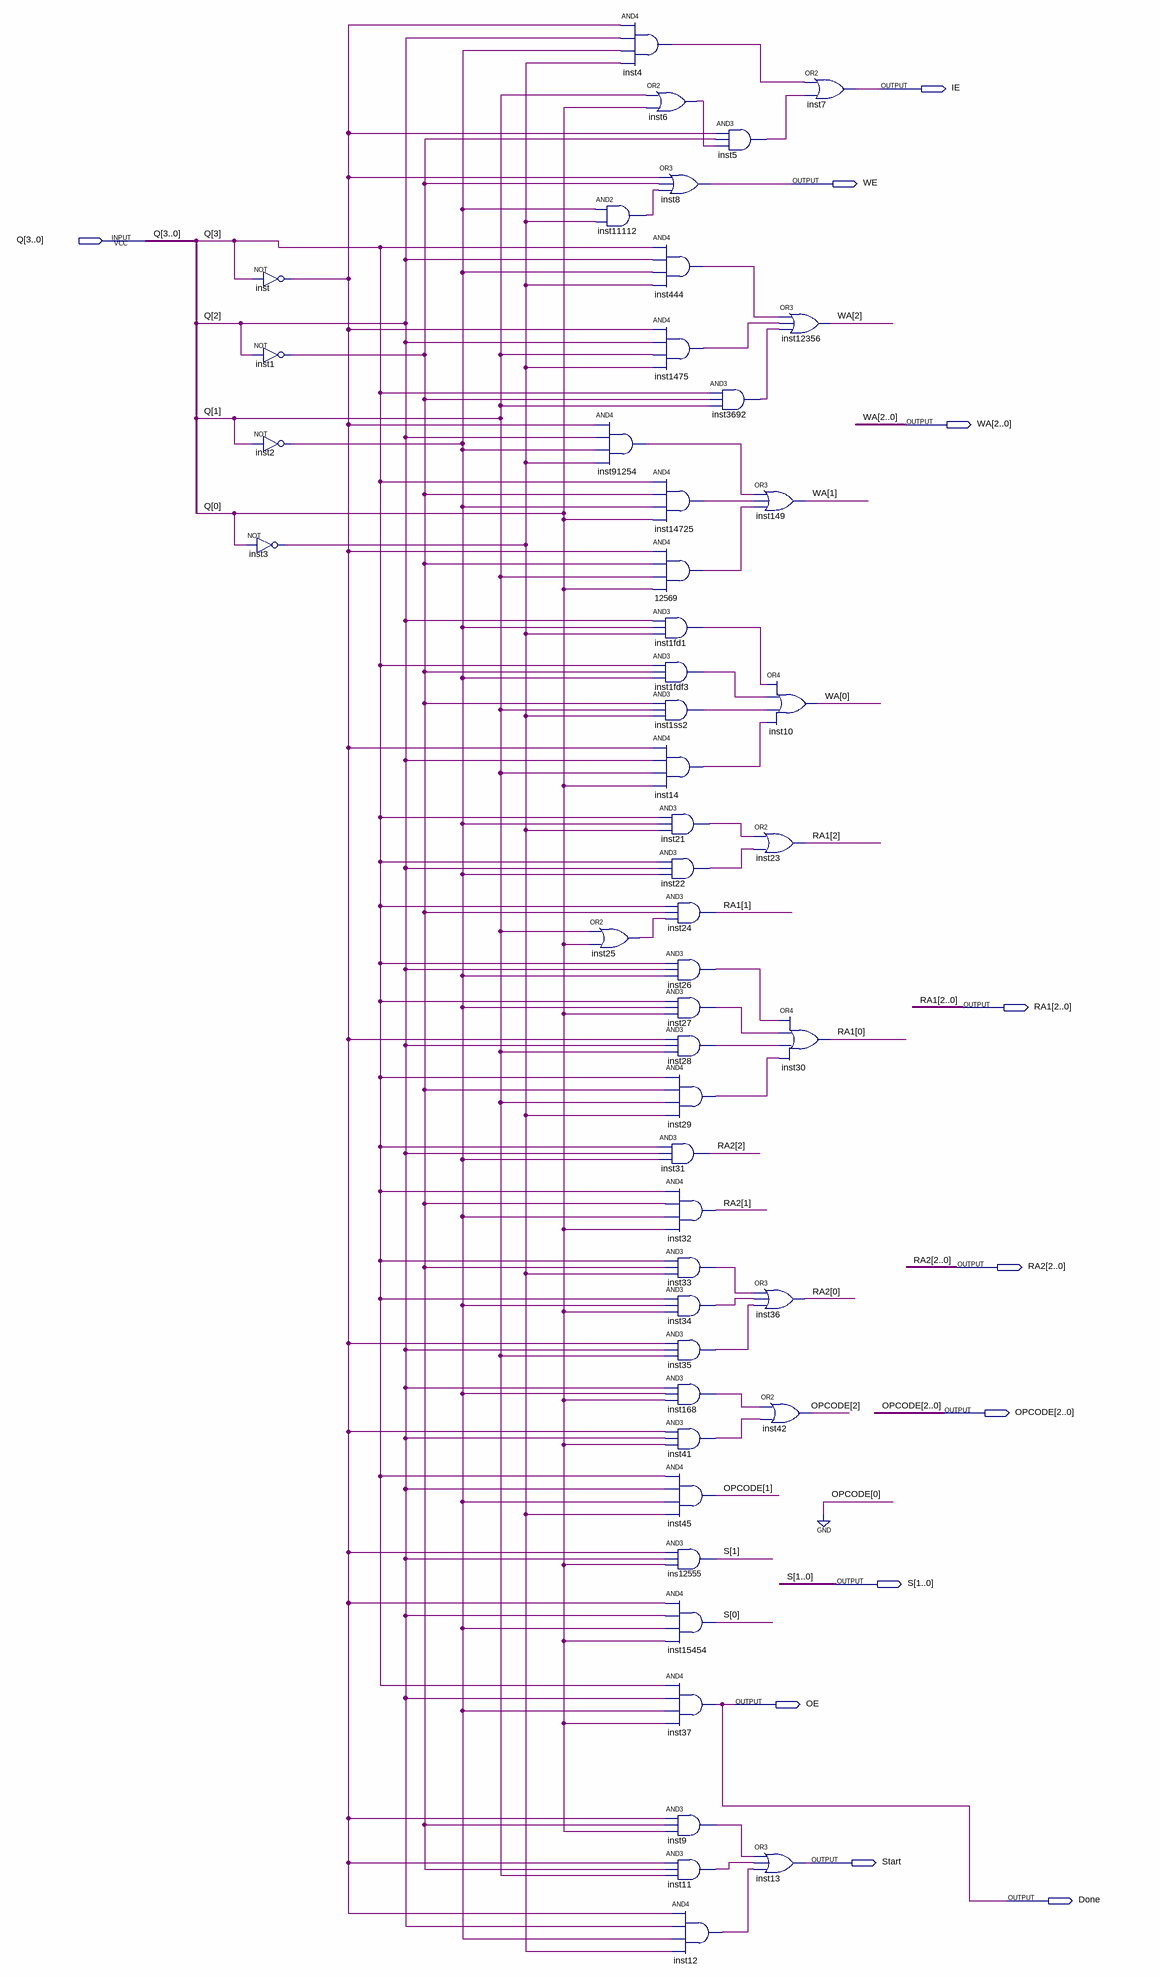
[diagram p0: schematic sheet]
// Quartus schematic OUTPUT.bdf as structural Verilog: 50 symbols, 11 pins
module OUTPUT (
  input  [3:0] Q,
  output IE,
  output WE,
  output [2:0] WA,
  output [2:0] RA1,
  output [2:0] RA2,
  output [2:0] OPCODE,
  output [1:0] S,
  output OE,
  output Start,
  output Done
);

  wire inst1_out, inst1fd1_out, inst1fdf3_out, inst1ss2_out, inst2_out, inst3_out, inst4_out, inst5_out,
       inst6_out, inst9_out, inst11_out, inst12_out, inst14_out, inst21_out, inst22_out, inst25_out,
       inst26_out, inst27_out, inst28_out, inst29_out, inst33_out, inst34_out, inst35_out, inst41_out,
       inst168_out, inst444_out, inst1475_out, inst3692_out, inst11112_out, inst14725_out, inst91254_out,
       inst_out, n12569_out;

  not inst3 (inst3_out, Q[0]);
  not inst (inst_out, Q[3]);
  not inst1 (inst1_out, Q[2]);
  not inst2 (inst2_out, Q[1]);
  and inst11112 (inst11112_out, inst2_out, inst3_out);
  and inst91254 (inst91254_out, inst_out, Q[2], inst2_out, inst3_out);
  or inst25 (inst25_out, Q[1], Q[0]);
  and inst4 (inst4_out, inst_out, Q[2], inst2_out, inst3_out);
  or inst6 (inst6_out, Q[1], Q[0]);
  and inst444 (inst444_out, Q[3], Q[2], inst2_out, inst3_out);
  and inst1475 (inst1475_out, inst_out, Q[2], Q[1], inst3_out);
  and inst14725 (inst14725_out, Q[3], inst1_out, inst2_out, Q[0]);
  and u_12569 (n12569_out, inst_out, inst1_out, Q[1], Q[0]);
  and inst1fd1 (inst1fd1_out, Q[2], inst2_out, inst3_out);
  and inst1fdf3 (inst1fdf3_out, Q[3], inst1_out, inst2_out);
  and inst1ss2 (inst1ss2_out, inst1_out, Q[1], inst3_out);
  and inst14 (inst14_out, inst_out, Q[2], Q[1], Q[0]);
  or inst8 (WE, inst_out, inst1_out, inst11112_out);
  and inst21 (inst21_out, Q[3], inst2_out, inst3_out);
  and inst22 (inst22_out, Q[3], Q[2], inst2_out);
  and inst24 (RA1[1], Q[3], inst1_out, inst25_out);
  and inst26 (inst26_out, Q[3], Q[2], inst2_out);
  and inst27 (inst27_out, Q[3], inst2_out, Q[0]);
  and inst28 (inst28_out, inst_out, Q[2], Q[1]);
  and inst29 (inst29_out, Q[3], inst1_out, Q[1], inst3_out);
  and inst31 (RA2[2], Q[3], Q[2], inst2_out);
  and inst32 (RA2[1], Q[3], inst1_out, inst2_out, Q[0]);
  and inst33 (inst33_out, Q[3], inst1_out, inst3_out);
  and inst34 (inst34_out, Q[3], inst2_out, Q[0]);
  and inst35 (inst35_out, inst_out, Q[2], Q[1]);
  and inst168 (inst168_out, Q[2], inst2_out, Q[0]);
  and inst41 (inst41_out, inst_out, Q[2], Q[0]);
  and inst45 (OPCODE[1], Q[3], Q[2], inst2_out, inst3_out);
  and ins12555 (S[1], inst_out, Q[2], Q[0]);
  and inst15454 (S[0], inst_out, Q[2], inst2_out, Q[0]);
  and inst37 (Done, Q[3], Q[2], inst2_out, Q[0]);
  and inst9 (inst9_out, inst_out, inst1_out, Q[0]);
  and inst11 (inst11_out, inst_out, inst1_out, Q[1]);
  and inst12 (inst12_out, inst_out, Q[2], inst2_out, inst3_out);
  and inst5 (inst5_out, inst_out, inst1_out, inst6_out);
  and inst3692 (inst3692_out, Q[3], inst1_out, Q[1]);
  or inst149 (WA[1], inst91254_out, inst14725_out, n12569_out);
  or inst23 (RA1[2], inst21_out, inst22_out);
  or inst36 (RA2[0], inst33_out, inst34_out, inst35_out);
  or inst13 (Start, inst9_out, inst11_out, inst12_out);
  or inst7 (IE, inst4_out, inst5_out);
  or inst12356 (WA[2], inst444_out, inst1475_out, inst3692_out);
  or inst10 (WA[0], inst1fd1_out, inst1fdf3_out, inst1ss2_out, inst14_out);
  or inst30 (RA1[0], inst26_out, inst27_out, inst28_out, inst29_out);
  or inst42 (OPCODE[2], inst168_out, inst41_out);

  assign OE = Done;
  assign OPCODE[0] = 1'b0;
endmodule
